# Altium schematic sheet ADPL Wiring Diagram.SchDoc
size A
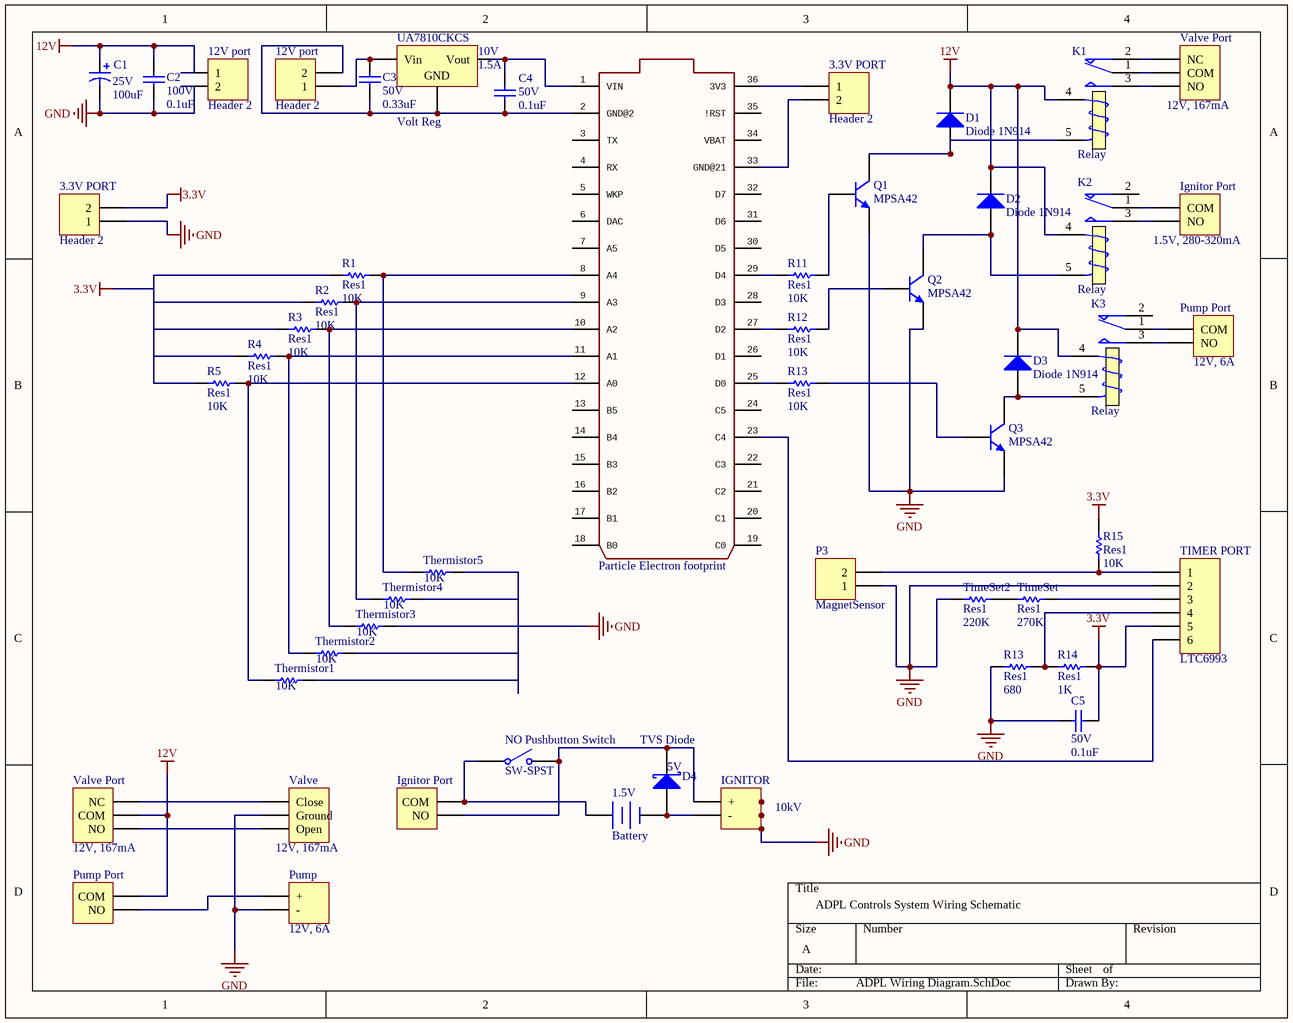
[diagram p0: ADPL Wiring Diagram.SchDoc]

## Parts
(Parts that share a designator on the sheet are numbered #1, #2 ... from top to bottom, then left to right.)
1.5V  Battery  [BAT-2]
3.3V_PORT#1  Header 2  [HDR1X2]
3.3V_PORT#2  Header 2  [HDR1X2]
12V_port#1  Header 2  [HDR1X2]
12V_port#2  Header 2  [HDR1X2]
?  Particle Electron footprint  [ELECTRON]
C1  25V  value 100uF  [RB7.6-15]
C2  100V  value 0.1uF  [C1206]
C3  50V  value 0.33uF  [RAD-0.3]
C4  50V  value 0.1uF  [RAD-0.3]
C5  50V  value 0.1uF  [RAD-0.3]
D1  Diode 1N914  [DO-35]
D2  Diode 1N914  [DO-35]
D3  Diode 1N914  [DO-35]
D4  TVS Diode  Working Voltage: 5V  [TO-220AC]
IGNITOR  Output: 10kV  [HDR1X2]
Ignitor_Port#1  1.5V, 280-320mA  [HDR1X2]
Ignitor_Port#2  (no value)  [HDR1X2]
K1  Relay  [MODULE5B]
K2  Relay  [MODULE5B]
K3  Relay  [MODULE5B]
NO_Pushbutton_Switch  SW-SPST  [SPST-2]
P3  MagnetSensor  [HDR1X2]
Pump  12V, 6A  [HDR1X2]
Pump_Port#1  12V, 6A  [HDR1X2]
Pump_Port#2  (no value)  [HDR1X2]
Q1  MPSA42  [TO-92A]
Q2  MPSA42  [TO-92A]
Q3  MPSA42  [TO-92A]
R1  Res1  value 10K  [AXIAL-0.3]
R2  Res1  value 10K  [AXIAL-0.3]
R3  Res1  value 10K  [AXIAL-0.3]
R4  Res1  value 10K  [AXIAL-0.3]
R5  Res1  value 10K  [AXIAL-0.3]
R11  Res1  value 10K  [AXIAL-0.3]
R12  Res1  value 10K  [AXIAL-0.3]
R13#1  Res1  value 10K  [AXIAL-0.3]
R13#2  Res1  value 680  [AXIAL-0.3]
R14  Res1  value 1K  [AXIAL-0.3]
R15  Res1  value 10K  [AXIAL-0.3]
Thermistor1  value 10K  [AXIAL-0.3]  (hidden comment: Res1)
Thermistor2  value 10K  [AXIAL-0.3]  (hidden comment: Res1)
Thermistor3  value 10K  [AXIAL-0.3]  (hidden comment: Res1)
Thermistor4  value 10K  [AXIAL-0.3]  (hidden comment: Res1)
Thermistor5  value 10K  [AXIAL-0.3]  (hidden comment: Res1)
TIMER_PORT  LTC6993  [HDR1X6]
TimeSet  Res1  value 270K  [AXIAL-0.3]
TimeSet2  Res1  value 220K  [AXIAL-0.3]
UA7810CKCS  Volt Reg  Voltage output: 10V  Current output: 1.5A  [D2PAK_N]
Valve  12V, 167mA  [HDR1X3]
Valve_Port#1  12V, 167mA  [HDR1X3]
Valve_Port#2  12V, 167mA  [HDR1X3]

## Nets
3.3V: 3.3V_PORT#2.2 C5.1 R14.1 R15.2 TIMER_PORT.5
12V: 12V_port#1.1 C1.1 C2.2 D1.2(K) D2.2(K) D3.2(K) K1.4(T1) K2.4(T1) K3.4(T1) Pump_Port#2.2(COM) Valve_Port#2.2(COM)
GND: 3.3V_PORT#2.1 12V_port#1.2 C1.2 C2.1 C5.2 P3.1 Pump.2(-) Q1.1(E) Q2.1(E) Q3.1(E) R13#2.2 Thermistor3.2 TIMER_PORT.2 TimeSet2.1 Valve.2(Ground)
Net1.5V_1: 1.5V.1(+) Ignitor_Port#2.2(COM) NO_Pushbutton_Switch.1(COMMON)
Net1.5V_2: 1.5V.2(-) D4.3(A) IGNITOR.2(-)
Net3.3V_PORT#1_1: 3.3V_PORT#1.1 ?.36(3V3)
Net3.3V_PORT#1_2: 3.3V_PORT#1.2 ?.33(GND@21)
Net12V_port#2_1: 12V_port#2.1 C3.2 UA7810CKCS.1(Vin)
Net12V_port#2_2: 12V_port#2.2 ?.2(GND@2) C3.1 C4.1 UA7810CKCS.2(GND)
Net?_1: ?.1(VIN) C4.2 UA7810CKCS.3(Vout)
Net?_8: ?.8(A4) R1.2 Thermistor5.1
Net?_9: ?.9(A3) R2.2 Thermistor4.1
Net?_10: ?.10(A2) R3.2 Thermistor3.1
Net?_11: ?.11(A1) R4.2 Thermistor2.1
Net?_12: ?.12(A0) R5.2 Thermistor1.1
Net?_23: ?.23(C4) TIMER_PORT.6
Net?_25: ?.25(D0) R13#1.1
Net?_27: ?.27(D2) R12.1
Net?_29: ?.29(D4) R11.1
NetD1_1: D1.1(A) K1.5(T2) Q1.3(C)
NetD2_1: D2.1(A) K2.5(T2) Q2.3(C)
NetD3_1: D3.1(A) K3.5(T2) Q3.3(C)
NetD4_1: D4.1(K) IGNITOR.1(+) Ignitor_Port#2.1(NO) NO_Pushbutton_Switch.2(NO)
NetIgnitor_Port#1_1: Ignitor_Port#1.1(COM) K2.1(COM)
NetIgnitor_Port#1_2: Ignitor_Port#1.2(NO) K2.3(NO)
NetK1_1: K1.1(COM) Valve_Port#1.2(COM)
NetK1_2: K1.2(NC) Valve_Port#1.1(NC)
NetK1_3: K1.3(NO) Valve_Port#1.3(NO)
NetK3_1: K3.1(COM) Pump_Port#1.1(COM)
NetK3_3: K3.3(NO) Pump_Port#1.2(NO)
NetP3_2: P3.2 R15.1 TIMER_PORT.1
NetPump_1: Pump.1(+) Pump_Port#2.1(NO)
NetQ1_2: Q1.2(B) R11.2
NetQ2_2: Q2.2(B) R12.2
NetQ3_2: Q3.2(B) R13#1.2
NetR13#2_1: R13#2.1 R14.2 TIMER_PORT.4
NetTIMER_PORT_3: TIMER_PORT.3 TimeSet.2
NetTimeSet_1: TimeSet.1 TimeSet2.2
NetValve_1: Valve.1(Close) Valve_Port#2.3(NC)
NetValve_3: Valve.3(Open) Valve_Port#2.1(NO)

Not connected (* = marked no-connect by the designer): ? 3(TX) 4(RX) 5(WKP) 6(DAC) 7(A5) 13(B5) 14(B4) 15(B3) 16(B2) 17(B1) 18(B0) 19(C0) 20(C1) 21(C2) 22(C3) 24(C5) 26(D1) 28(D3) 30(D5) 31(D6) 32(D7) 34(VBAT) 35(!RST); K2 2(NC); K3 2(NC); R1 1; R2 1; R3 1; R4 1; R5 1; Thermistor1 2; Thermistor2 2; Thermistor4 2; Thermistor5 2

## Notes on the sheet
- ADPL Controls System Wiring Schematic

## Library data of the parts
1.5V = Battery: Multicell Battery; Published: 24-Mar-1999; LatestRevisionDate: 17-Jul-2002; LatestRevisionNote: Re-released for DXP Platform.; PackageReference: BAT-2; Publisher: Altium Limited; PackageDescription: Battery; 2 Leads
3.3V_PORT#1 3.3V_PORT#2 12V_port#1 12V_port#2 Ignitor_Port#1 Ignitor_Port#2 Pump_Port#1 Pump_Port#2 = Header 2: Header, 2-Pin; LatestRevisionDate: 17-Jul-2002; LatestRevisionNote: Re-released for DXP Platform.; Publisher: Altium Limited
? = ELECTRON_WITH_HEADERS
C1 = Cap Pol1: Polarized Capacitor (Radial); Part#: 75-516D107M025LM6AE3; Published: 8-Jun-2000; LatestRevisionDate: 17-Jul-2002; LatestRevisionNote: Re-released for DXP Platform.; PackageReference: RB7.6-15; Publisher: Altium Limited; PackageDescription: Polarized Capacitor (Radial); 2 Leads
C2 = Cap Semi: Capacitor (Semiconductor SIM Model); Part#: 581-SA111E104MAR; Published: 8-Jun-2000; LatestRevisionDate: 29-May-2009; LatestRevisionNote: IPC-7351 Footprint Added.; PackageReference: C1206; Publisher: Altium Limited; PackageDescription: Chip Capacitor
C3 C4 = Cap: Capacitor; Published: 8-Jun-2000; LatestRevisionDate: 17-Jul-2002; LatestRevisionNote: Re-released for DXP Platform.; PackageReference: RAD-0.3; Publisher: Altium Limited; PackageDescription: Radial Cap, Thru-Hole; 2 Leads; 0.3 in Pin Spacing
C5 = cap: Capacitor; Published: 8-Jun-2000; LatestRevisionDate: 17-Jul-2002; LatestRevisionNote: Re-released for DXP Platform.; PackageReference: RAD-0.3; Publisher: Altium Limited; PackageDescription: Radial Cap, Thru-Hole; 2 Leads; 0.3 in Pin Spacing
D1-D3 = Diode 1N914: High Conductance Fast Diode; Published: 8-Jun-2000; LatestRevisionDate: 17-Jul-2002; LatestRevisionNote: Re-released for DXP Platform.; DatasheetVersion: 1997; PackageReference: DO-35; Publisher: Altium Limited; PackageDescription: Diode, Axial; Body 3.8 x 1.9 mm (LxDia. max), Lead Dia. 0.53 mm (max); Code_JEDEC: DO-204-AH; ComponentLink1Description: Manufacturer Link; ComponentLink1URL: http://www.fairchildsemi.com/; ComponentLink2Description: Datasheet; ComponentLink2URL: http://www.fairchildsemi.com/ds/1N%2F1N4448.pdf
D4 = Diode 10TQ040: TVS Diode - Birectional; Part#: SA5.0CA; Note: Terminal 2 is the TAB and is electrically connected to the cathode; Clamping voltage: 9.6V; Published: 8-Jun-2000; LatestRevisionDate: 17-Jul-2002; LatestRevisionNote: Re-released for DXP Platform.; DatasheetVersion: PD-2.057B; PackageVersion: Feb-1998; PackageReference: TO-220AC; Publisher: Altium Limited; PackageDescription: TO, Thru-Hole, Vertical, Heatsink Mounted; 3 In-Line Leads (1 Absent); Pitch 2.54 mm; ComponentLink1Description: Manufacturer Link; ComponentLink1URL: http://www.irf.com/
IGNITOR Pump = Header 2: Header, 2-Pin; Input: 1.5VDC, 280-320mA; LatestRevisionDate: 17-Jul-2002; LatestRevisionNote: Re-released for DXP Platform.; Publisher: Altium Limited
K1-K3 = Relay: SPDT Relay; Part#: 817-FTR-F1CA012V; Published: 8-Jun-2000; LatestRevisionDate: 17-Jul-2002; LatestRevisionNote: Re-released for DXP Platform.; PackageReference: MODULE5B; Publisher: Altium Limited
NO_Pushbutton_Switch = SW-SPST: Single-Pole, Single-Throw Switch; Published: 24-Mar-1999; LatestRevisionDate: 17-Jul-2002; LatestRevisionNote: Re-released for DXP Platform.; PackageReference: SPST-2; Publisher: Altium Limited; PackageDescription: Switch; 2 Leads
P3 = Header 2: Header, 2-Pin; Resistance: Contact on maximum resistance: ≤10kΩ   Open contact minimum resistance: ≥500kΩ; LatestRevisionDate: 17-Jul-2002; LatestRevisionNote: Re-released for DXP Platform.; Publisher: Altium Limited; Source: http://www.amazon.com/GERI-Counter-Digital-Proximity-Magnetic/dp/B01875612U/ref=sr_1_2?ie=UTF8&qid=1456764906&sr=8-2&keywords=magnetic+counter
Q1-Q3 = 2N3904: NPN General Purpose Amplifier; Part#: 512-MPSA42; Published: 8-Jun-2000; LatestRevisionDate: 17-Jan-2003; LatestRevisionNote: PCB Footprint replaced; DatasheetVersion: 1997; PackageVersion: Sep-1998; PackageReference: TO-92A; Publisher: Altium Limited; PackageDescription: TO, Flat Index; 3 In-Line, Axial Leads; Body Dia. 4.5mm; Leads 0.51 x 0.48 mm (max); ComponentLink1Description: Manufacturer Link; ComponentLink1URL: http://www.fairchildsemi.com/; ComponentLink2Description: Datasheet; ComponentLink2URL: http://www.fairchildsemi.com/ds/2N%2F2N3904.pdf
R1-R5 R11 R12 R13#1 R15 = Res1: Resistor; Published: 8-Jun-2000; LatestRevisionDate: 17-Jul-2002; LatestRevisionNote: Re-released for DXP Platform.; PackageReference: AXIAL-0.3; Publisher: Altium Limited; PackageDescription: Axial Device, Thru-Hole; 2 Leads; 0.3 in Pin Spacing
R13#2 = Res1: Resistor; Part#: 660-CF1/4C681J; Published: 8-Jun-2000; LatestRevisionDate: 17-Jul-2002; LatestRevisionNote: Re-released for DXP Platform.; PackageReference: AXIAL-0.3; Publisher: Altium Limited; PackageDescription: Axial Device, Thru-Hole; 2 Leads; 0.3 in Pin Spacing
R14 = Res1: Resistor; Part#: 660-CF1/4CT52R102J; Published: 8-Jun-2000; LatestRevisionDate: 17-Jul-2002; LatestRevisionNote: Re-released for DXP Platform.; PackageReference: AXIAL-0.3; Publisher: Altium Limited; PackageDescription: Axial Device, Thru-Hole; 2 Leads; 0.3 in Pin Spacing
Thermistor1 Thermistor2 Thermistor4 Thermistor5 = Res1: Resistor; Part#: NTCAIMME3C90373; Published: 8-Jun-2000; LatestRevisionDate: 17-Jul-2002; LatestRevisionNote: Re-released for DXP Platform.; PackageReference: AXIAL-0.3; Publisher: Altium Limited; PackageDescription: Axial Device, Thru-Hole; 2 Leads; 0.3 in Pin Spacing
Thermistor3 = Res1: Resistor; Part#: Dwyer I2-1B062; Published: 8-Jun-2000; LatestRevisionDate: 17-Jul-2002; LatestRevisionNote: Re-released for DXP Platform.; PackageReference: AXIAL-0.3; Publisher: Altium Limited; PackageDescription: Axial Device, Thru-Hole; 2 Leads; 0.3 in Pin Spacing
TIMER_PORT = Header 6: Header, 6-Pin; LatestRevisionDate: 17-Jul-2002; LatestRevisionNote: Re-released for DXP Platform.; Publisher: Altium Limited; Order: http://www.linear.com/product/LTC6993-1
TimeSet = Res1: Resistor; Part#: 660-CF1/4CT52R274J; Published: 8-Jun-2000; LatestRevisionDate: 17-Jul-2002; LatestRevisionNote: Re-released for DXP Platform.; PackageReference: AXIAL-0.3; Publisher: Altium Limited; PackageDescription: Axial Device, Thru-Hole; 2 Leads; 0.3 in Pin Spacing
TimeSet2 = Res1: Resistor; Part#: 660-CF1/4CT52R224J; Published: 8-Jun-2000; LatestRevisionDate: 17-Jul-2002; LatestRevisionNote: Re-released for DXP Platform.; PackageReference: AXIAL-0.3; Publisher: Altium Limited; PackageDescription: Axial Device, Thru-Hole; 2 Leads; 0.3 in Pin Spacing
UA7810CKCS = Volt Reg: Voltage Regulator; Part#: UA7810CKCS; Voltage input: 12.5-28V; Published: 24-Mar-1999; LatestRevisionDate: 29-May-2009; LatestRevisionNote: IPC-7351 Footprint Added.; PackageReference: D2PAK; Publisher: Altium Limited; PackageDescription: 3-Pin Transistor Outline Package 2.54 mm Pitch, 15.1 mm Lead Span
Valve Valve_Port#1 Valve_Port#2 = Header 3: Header, 3-Pin; Part#: CWX-15Q, CR-02; LatestRevisionDate: 17-Jul-2002; LatestRevisionNote: Re-released for DXP Platform.; Publisher: Altium Limited